# EAGLE schematic SA Schematic (EAGLE 6.5.0)
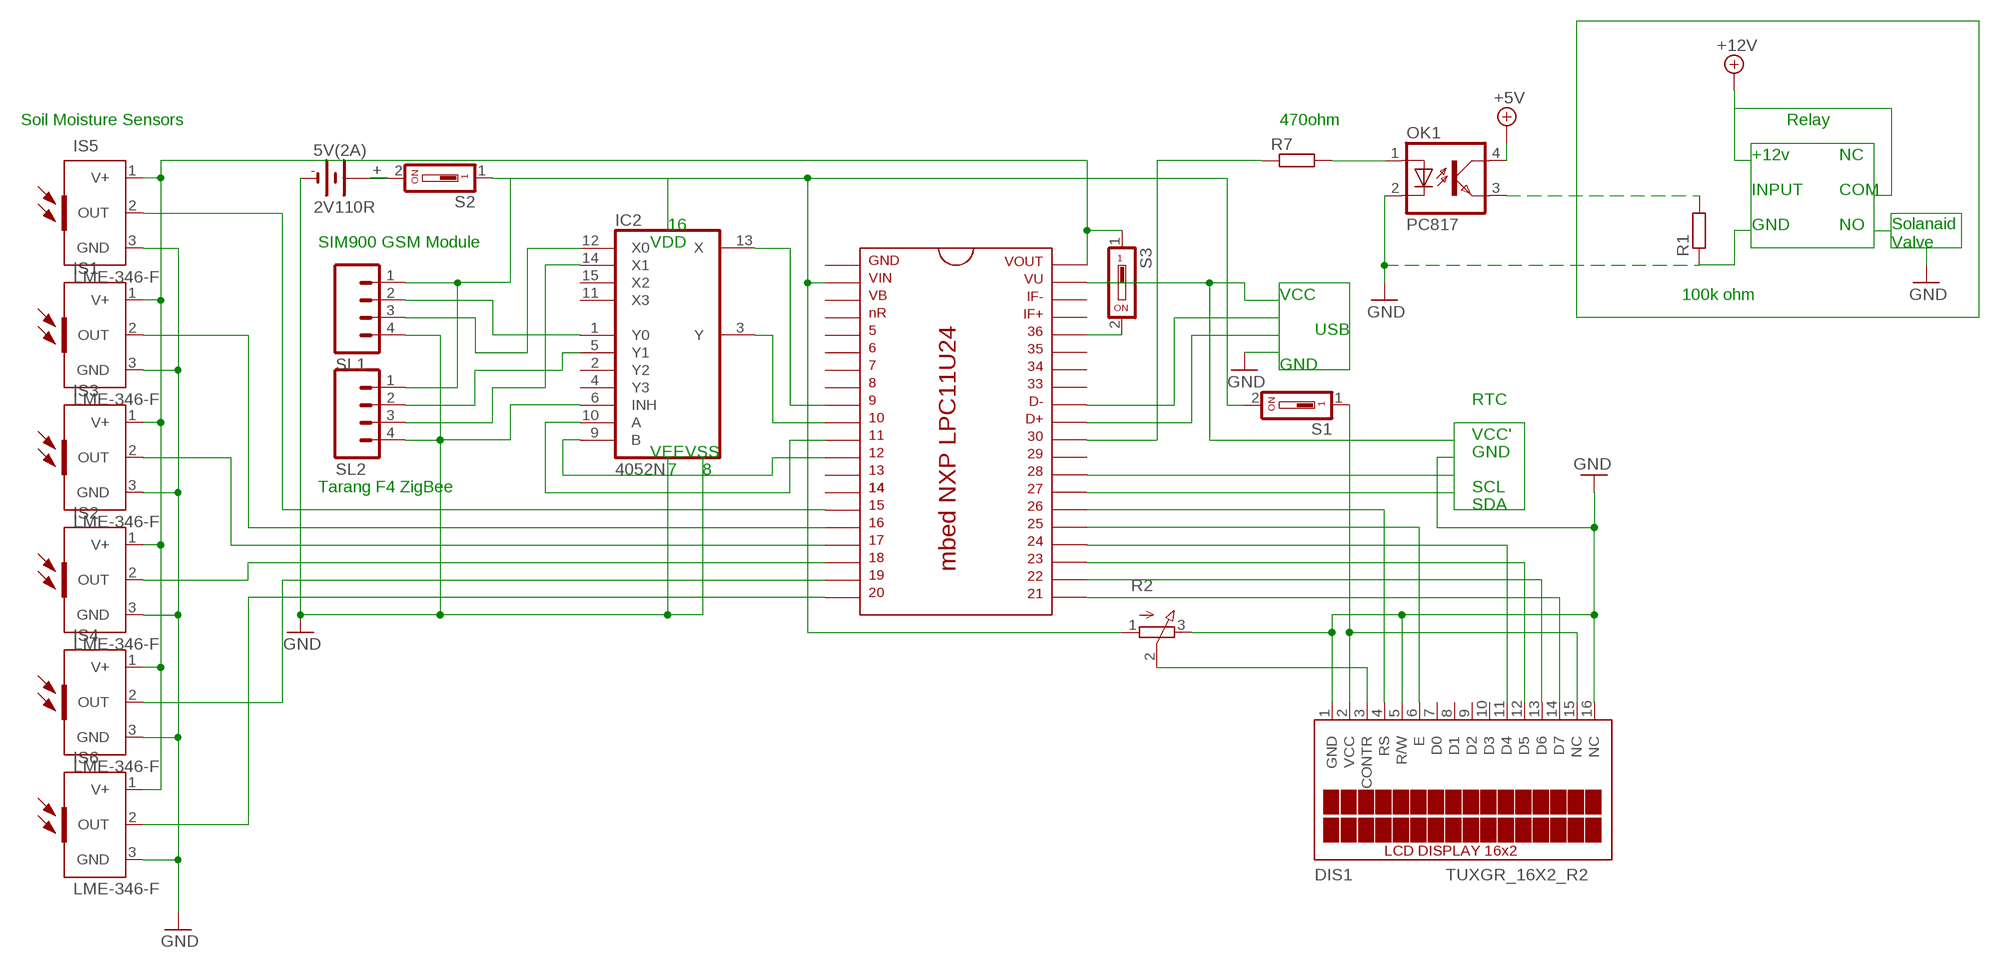
[diagram p0: schematic, sheet 1]

## Parts
5V(2A)  2V110R  [2V110R]
DIS1  TUXGR_16X2_R2  [TUXGR_16X2_R2]
IC1  MBED-NXP-LPC11U24  [DIL40_0.9]
IC2  4052N  [DIL16]
IS1  LME-346-F  [TO39]
IS2  LME-346-F  [TO39]
IS3  LME-346-F  [TO39]
IS4  LME-346-F  [TO39]
IS5  LME-346-F  [TO39]
IS6  LME-346-F  [TO39]
OK1  PC817  [DIL04]
R1  R-EU_0204/2V  [0204V]
R2  3RP/1610N  [3RP/1610N]
R7  R-EU_0204/2V  [0204V]
S1  DS01  [DS-01]
S2  DS01  [DS-01]
S3  DS01  [DS-01]
SL1  M04  [04P]
SL2  M04  [04P]

## Nets
5V: DIS1.2(VCC) DIS1.15(NC) S1.1
+5V: OK1.4(COL)
GND: 5V(2A).- DIS1.1(GND) DIS1.5(R/W) DIS1.16(NC) IC1.27 IC1.28 IC1.31 IC1.32 IC1.39 IC2.6(INH) IS1.3(GND) IS2.3(GND) IS3.3(GND) IS4.3(GND) IS5.3(GND) IS6.3(GND) OK1.2(C) R1.1 R2.3(E) SL1.4 SL2.4 ; supply symbol labelled +12V
N$1: IC1.9 IC2.13(X)
N$2: OK1.3(EMIT) R1.2
N$3: IC1.15 IS5.2(OUT)
N$5: DIS1.14(D7) IC1.21
N$6: DIS1.13(D6) IC1.22
N$7: DIS1.12(D5) IC1.23
N$8: DIS1.11(D4) IC1.24
N$9: DIS1.6(E) IC1.25
N$10: DIS1.4(RS) IC1.26
N$11: IC1.18 IS2.2(OUT)
N$12: IC1.10 IC2.3(Y)
N$13: IC1.16 IS1.2(OUT)
N$14: IC1.17 IS3.2(OUT)
N$15: IC2.1(Y0) SL1.2
N$16: IC1.19 IS4.2(OUT)
N$17: R2.2(S)
N$18: IC1.11 IC2.10(A)
N$19: DIS1.3(CONTR)
N$20: IC1.40 IS1.1(V+) IS2.1(V+) IS3.1(V+) IS4.1(V+) IS5.1(V+) IS6.1(V+) S3.1
N$21: IC1.12 IC2.9(B)
N$22: IC1.2 R2.1(A) S1.2 S2.1 SL1.1 SL2.1
N$23: 5V(2A).+ 5V(2A).+@1(+) S2.2
N$24: IC2.5(Y1) SL2.2
N$25: IC1.30 R7.1
N$26: OK1.1(A) R7.2
N$27: IC2.12(X0) SL1.3
N$28: IC2.14(X1) SL2.3
N$29: IC1.36 S3.2
N$32: IC1.20 IS6.2(OUT)
Unconnected: DIS1.7(D0) DIS1.8(D1) DIS1.9(D2) DIS1.10(D3) IC1.1 IC1.3 IC1.4 IC1.5 IC1.6 IC1.7 IC1.8 IC1.13 IC1.14 IC1.29 IC1.33 IC1.34 IC1.35 IC1.37 IC1.38 IC2.2(Y2) IC2.4(Y3) IC2.11(X3) IC2.15(X2)

## Notes on the sheet
- Soil Moisture Sensors | 470ohm | Relay
- +12v | NC
- INPUT | COM
- 16 | GND | NO
- SIM900 GSM Module | VDD
- Solanaid
  Valve
- VCC | 100k ohm
- USB
- GND
- RTC
- VCC'
- VEE | VSS | GND
- 7 | 8
- Tarang F4 ZigBee | SCL
- SDA

## Power pins joined to a net without a drawn wire
GND: IC2.8(GND)
VCC: IC2.16(VCC)
VEE: IC2.7(VEE)

## Library data of the parts
5V(2A) = battery:2V110R: NC ACCU Varta
DIS1 = display-lcd:TUXGR_16X2_R2: Tuxgraphics LCD display 16x2 characters reflective, without background light Source: tuxgr_12x2_r2.pdf; OC_FARNELL: unknown; OC_NEWARK: unknown
IC1 = mbed-microcontroller:MBED-NXP-LPC11U24
IC2 = 40xx:4052: Dual 4-channel ANALOG MULTIPLEXER
IS1-IS6 = sensor-infratec:LME-346-F: pyroelectric detector Source: http://www.InfraTec.de .. Datasheet_S85159.pdf; OC_FARNELL: unknown; OC_NEWARK: unknown
OK1 = optocoupler:PC817: SHARP OPTO COUPLER; MPN: PC817X4J000F; OC_FARNELL: 9707727; OC_NEWARK: 97K7059
R1 R7 = resistor:R-EU_: RESISTOR, European symbol
R2 = pot:3RP/1610N: 16mm Potentiometer one level Source: http://www.alphapotentiometers.net/html/16mm_pot_2.html
S1-S3 = switch-dil:DS01: DIL/CODE SWITCH; OC_FARNELL: unknown; OC_NEWARK: unknown
SL1 SL2 = con-amp-quick:M04: AMP QUICK CONNECTOR; OC_FARNELL: unknown; OC_NEWARK: unknown